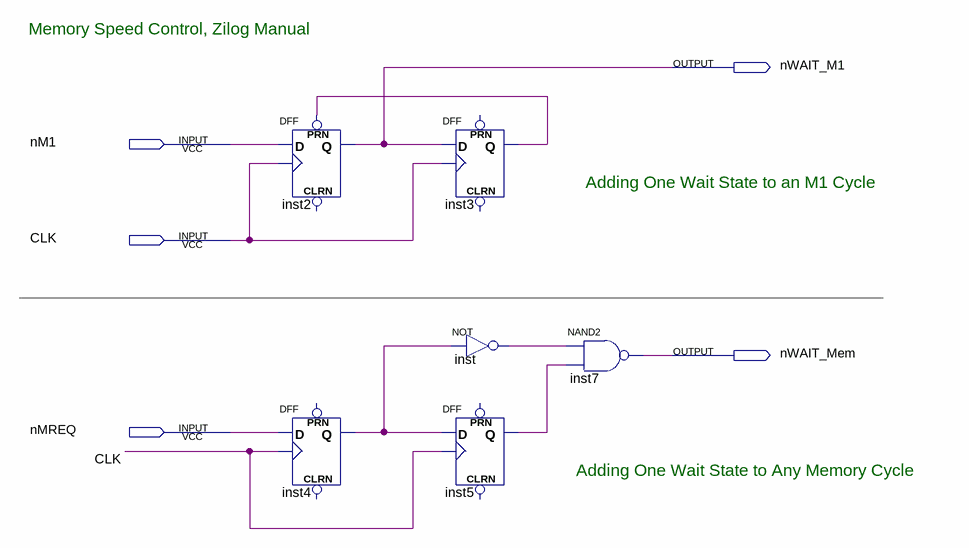
[diagram p0: schematic sheet]
// Quartus schematic wait_state.bdf as structural Verilog: 6 symbols, 5 pins
module wait_state (
  input  nM1,
  input  CLK,
  input  nMREQ,
  output nWAIT_M1,
  output nWAIT_Mem
);

  wire inst3_q, inst4_q, inst5_q, inst_out;

  DFF inst2 (.CLK(CLK), .D(nM1), .PRN(inst3_q), .Q(nWAIT_M1));  // open: CLRN
  DFF inst4 (.CLK(CLK), .D(nMREQ), .Q(inst4_q));  // open: CLRN, PRN
  DFF inst3 (.CLK(CLK), .D(nWAIT_M1), .Q(inst3_q));  // open: CLRN, PRN
  not inst (inst_out, inst4_q);
  DFF inst5 (.CLK(CLK), .D(inst4_q), .Q(inst5_q));  // open: CLRN, PRN
  nand inst7 (nWAIT_Mem, inst_out, inst5_q);

  // Notes on the sheet:
  //   Memory Speed Control, Zilog Manual
  //   Adding One Wait State to an M1 Cycle
  //   Adding One Wait State to Any Memory Cycle
endmodule
